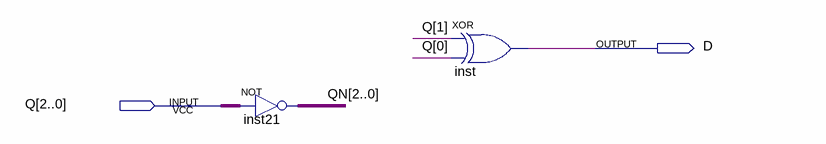
[diagram p0: schematic sheet]
// Quartus schematic D1.bdf as structural Verilog: 2 symbols, 2 pins
module D1 (
  input  [2:0] Q,
  output D
);

  wire [2:0] QN;

  assign QN = ~Q;  // NOT inst21, 3 bits wide
  xor inst (D, Q[1], Q[0]);
endmodule
